# EAGLE design Motor Controller V.5 (EAGLE 9.6.2)
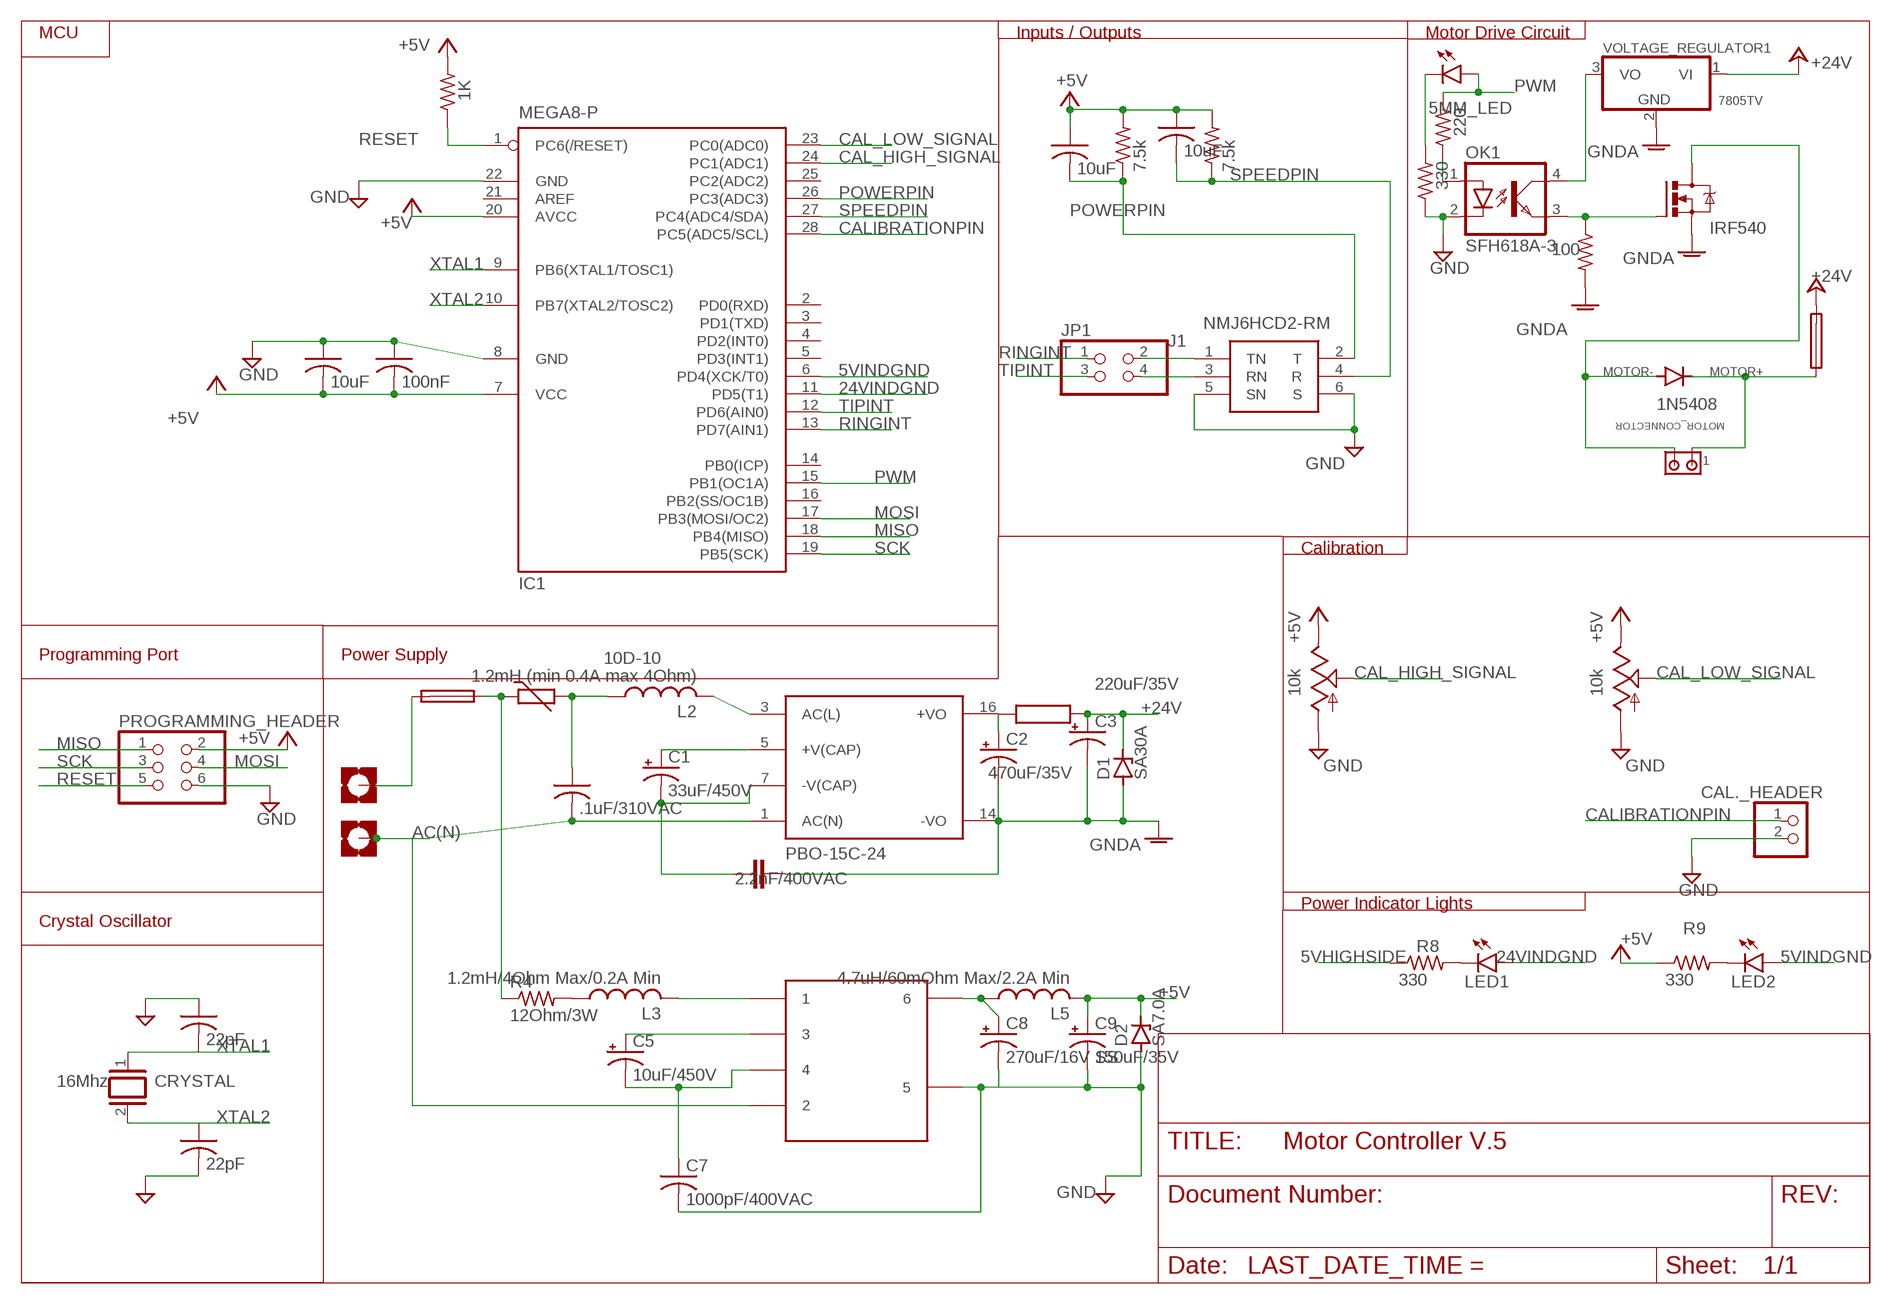
[diagram p0: schematic, sheet 1]

## Parts
1N5408  1N5408  1N5400  [DO201-15]
AC(N)  PAD3.0  [3,0-PAD-SQUARE]
C1  33uF/450V  CPOL-USE5-13  [E5-13]
C2  470uF/35V  CPOL-USE5-10.5  [E5-10,5]
C3  220uF/35V  CPOL-USE5-10.5  [E5-10,5]
C4  .1uF/310VAC  CMPP_AC275V104K10S6  [C102-064X133]
C5  10uF/450V  CPOL-USE5-10.5  [E5-10,5]
C6  22pF  C-US025-024X044  [C025-024X044]
C7  1000pF/400VAC  C-US075-052X106  [C075-052X106]
C8  270uF/16V SS  CPOL-USE2.5-6  [E2,5-6]
C9  150uF/35V  CPOL-USE3.5-8  [E3,5-8]
C10  10uF  C-US025-024X044  [C025-024X044]
C12  10uF  C-US025-024X044  [C025-024X044]
C13  10uF  C-US025-024X044  [C025-024X044]
C14  100nF  C-US025-024X044  [C025-024X044]
C15  22pF  C-US025-024X044  [C025-024X044]
CAL._HEADER  PINHD-1X2  [1X02]
CRYSTAL  16Mhz  XTAL/S  [QS]
CY1  2.2nF/400VAC  CYYC10B4  [YC10B4]
D1  SA30A  TVSDIO  [TVS-10]
D2  SA7.0A  TVSDIO  [TVS-10]
F1  FUSESH22,5  [SH22,5]
F2  1A/300V  FUSESH22,5  [SH22,5]
FAST  10k  TRIM_US-CT6  [CT6]
H1  PAD3.0  [3,0-PAD-SQUARE]
IC1  MEGA8-P  [DIL28-3]
J1  NMJ6HCD2-RM  [NMJ6HCD2RM]
JP1  PINHD-2X2  [2X02]
L2  1.2mH (min 0.4A max 4Ohm)  RCP_1317_INDUCTOR  [RCP1317_INDUCTOR]
L3  1.2mH/4Ohm Max/0.2A Min  RCP_1317_INDUCTOR  [RCP1317_INDUCTOR]
L5  4.7uH/60mOhm Max/2.2A Min  RLB0914_INDUCTOR  [RLB0914_INDUCTOR]
LED1  LED3MM  [LED3MM]
LED2  LED3MM  [LED3MM]
MOTOR_CONNECTOR  MATE-N-LOK_193839-1  [MATE-N-LOK_2PIN_CONNECTOR]
OK1  SFH618A-3  [DIP4]
PROGRAMMING_HEADER  PINHD-2X3  [2X03]
PS1  PBO-15C-24  [CONV_PBO-15C-24]
Q1  IRF540  [TO220BV]
R1  10D-10  THERMISTOR-7,5  [R-7,5]
R2  1K  R-US_0204/7  [0204/7]
R3  7.5k  R-US_0204/7  [0204/7]
R4  12Ohm/3W  R-US_VTA52  [VTA52]
R5  220  R-US_0204/7  [0204/7]
R6  100  R-US_0204/7  [0204/7]
R7  7.5k  R-US_0204/7  [0204/7]
R8  330  R-US_0204/7  [0204/7]
R9  330  R-US_0204/7  [0204/7]
R10  330  R-US_0204/7  [0204/7]
SLOW  10k  TRIM_US-CT6  [CT6]
U$1  L503-13B05R  [LS03-13BO5R3]
U$2  HCTI-22-16.4  [HCTI-22-16.4]
U$3  5MM_LED  [5MM_LED]
VOLTAGE_REGULATOR1  7805TV  [TO220V]

## Nets
5VHIGHSIDE: R8.1
5VINDGND: IC1.6(PD4(XCK/T0)) LED2.A
24VINDGND: IC1.11(PD5(T1)) LED1.A
+5V: C9.+ C10.1 C12.1 C13.2 C14.2 D2.C FAST.E IC1.7(VCC) IC1.20(AVCC) L5.P$2 PROGRAMMING_HEADER.2 R2.2 R3.2 R7.2 R9.1 SLOW.E
+24V: C3.+ D1.C F1.2 U$2.P$2 VOLTAGE_REGULATOR1.1(VI)
AC(L): L2.P$2 PS1.3(AC(L))
AC(N): AC(N).B3,0(MOUNT) C4.2 PS1.1(AC(N)) U$1.3 U$1.4
CAL_HIGH_SIGNAL: FAST.S IC1.24(PC1(ADC1))
CAL_LOW_SIGNAL: IC1.23(PC0(ADC0)) SLOW.S
CALIBRATIONPIN: CAL._HEADER.1 IC1.28(PC5(ADC5/SCL))
GND: C6.2 C7.2 C8.- C9.- C13.1 C14.1 C15.1 CAL._HEADER.2 D2.A FAST.A IC1.8(GND) IC1.22(GND) J1.5(SN) J1.6(S) OK1.2(C) PROGRAMMING_HEADER.6 R10.1 SLOW.A U$1.9 U$1.10
GNDA: C2.- C3.- CY1.1 D1.A PS1.14(-VO) Q1.S R6.2 VOLTAGE_REGULATOR1.2(GND)
MISO: IC1.18(PB4(MISO)) PROGRAMMING_HEADER.1
MOSI: IC1.17(PB3(MOSI/OC2)) PROGRAMMING_HEADER.4
MOTOR+: 1N5408.C F1.1 MOTOR_CONNECTOR.P$1
MOTOR-: 1N5408.A MOTOR_CONNECTOR.P$2 Q1.D
N$1: OK1.1(A) R5.1
N$2: OK1.3(EMIT) Q1.G R6.1
N$3: LED1.K(C) R8.2
N$4: C2.+ PS1.16(+VO) U$2.P$1
N$5: C1.+ PS1.5(+V(CAP))
N$6: C1.- CY1.2 PS1.7(-V(CAP))
N$7: J1.1(TN) JP1.2
N$8: F2.2 H1.B3,0(MOUNT)
N$9: F2.1 R1.1 R4.1
N$10: C4.1 L2.P$1 R1.2
N$11: J1.3(RN) JP1.4
N$12: LED2.K(C) R9.2
N$13: L3.P$1 R4.2
N$14: L3.P$2 U$1.1 U$1.2
N$15: C5.+ U$1.5 U$1.6
N$16: C5.- C7.1 U$1.7 U$1.8
N$17: C8.+ L5.P$1 U$1.11 U$1.12
N$18: OK1.4(COL) VOLTAGE_REGULATOR1.3(VO)
N$19: R10.2 U$3.C
POWERPIN: C10.2 IC1.26(PC3(ADC3)) J1.2(T) R3.1
PWM: IC1.15(PB1(OC1A)) R5.2 U$3.A
RESET: IC1.1(PC6(/RESET)) PROGRAMMING_HEADER.5 R2.1
RINGINT: IC1.13(PD7(AIN1)) JP1.1
SCK: IC1.19(PB5(SCK)) PROGRAMMING_HEADER.3
SPEEDPIN: C12.2 IC1.27(PC4(ADC4/SDA)) J1.4(R) R7.1
TIPINT: IC1.12(PD6(AIN0)) JP1.3
XTAL1: C15.2 CRYSTAL.1 IC1.9(PB6(XTAL1/TOSC1))
XTAL2: C6.1 CRYSTAL.2 IC1.10(PB7(XTAL2/TOSC2))
Unconnected: IC1.2(PD0(RXD)) IC1.3(PD1(TXD)) IC1.4(PD2(INT0)) IC1.5(PD3(INT1)) IC1.14(PB0(ICP)) IC1.16(PB2(SS/OC1B)) IC1.21(AREF) IC1.25(PC2(ADC2))

## Notes on the sheet
- MCU | Inputs / Outputs | Motor Drive Circuit
- Calibration
- Programming Port | Power Supply
- Power Indicator Lights
- Crystal Oscillator

## Library data of the parts
1N5408 = diode:1N5400: DIODE standard rectifier, 3 A, 50 V (Motorola); MF: VISHAY; MPN: 1N5408-E3/54; OC_NEWARK: 05R6001
AC(N) H1 = Benson Motor Controller:PAD3.0; OC_NEWARK: unknown
C1 C5 C8 C9 = rcl:CPOL-US: POLARIZED CAPACITOR, American symbol; OC_NEWARK: unknown; SPICEPREFIX: C
C2 = rcl:CPOL-US: POLARIZED CAPACITOR, American symbol; MF: PANASONIC; MPN: ECA1VHG471B; OC_NEWARK: 65AH6137; SPICEPREFIX: C
C3 = rcl:CPOL-US: POLARIZED CAPACITOR, American symbol; MF: KEMET; MPN: A768KS227M1VLAE024; OC_NEWARK: 92AH3968; SPICEPREFIX: C
C4 = Benson Motor Controller:CMPP_AC275V104K10S6: capacitor .1uf 275VAC; OC_NEWARK: unknown
C6 C7 C10 C12-C15 = rcl:C-US: CAPACITOR, American symbol; OC_NEWARK: unknown; SPICEPREFIX: C
CAL._HEADER = pinhead:PINHD-1X2: PIN HEADER; OC_NEWARK: unknown
CRYSTAL = special:XTAL/S: CRYSTAL; OC_NEWARK: unknown
CY1 = rcl:CY: Y CAPACITOR for power line; OC_NEWARK: unknown; SPICEPREFIX: C
D1 D2 = Benson Motor Controller:TVSDIO: TVS diode 9.0mm hole spacing; OC_NEWARK: unknown
F1 F2 = fuse:FUSE: Fuse; OC_FARNELL: unknown; OC_NEWARK: unknown
FAST SLOW = pot:TRIM_US-: POTENTIOMETER; OC_NEWARK: unknown
IC1 = atmel:MEGA8-P: MICROCONTROLLER 8 Kbytes FLASH, 1 kbytes SRAM, 512 bytes EEPROM, USART, 4-channel 10 bit ADC, 2-channel 8 bit ADC Pin compatible with Atmega48, ATMega88, ATMega168 Source: avr.lbr; OC_FARNELL: unknown; OC_NEWARK: unknown
J1 = SamacSys_Parts:NMJ6HCD2-RM: NMJ6HCD2-RM Phone Connectors 1/4" STERO JCK SWTCH FULL TRD NSE PC HORZ Source: Datasheet <https://www.mouser.com/datasheet/2/289/st-nmj6hcd2-1842677.pdf>; DESCRIPTION: NMJ6HCD2-RM Phone Connectors 1/4" STERO JCK SWTCH FULL TRD NSE PC HORZ; HEIGHT: 15.67mm; MANUFACTURER_NAME: Neutrik; MANUFACTURER_PART_NUMBER: NMJ6HCD2-RM; MOUSER_PART_NUMBER: 568-NMJ6HCD2-RM; MOUSER_PRICE-STOCK: https://www.mouser.co.uk/ProductDetail/Neutrik/NMJ6HCD2-RM?qs=%252B86TLfaev28zLpqKj2fOGg%3D%3D; OC_NEWARK: unknown
JP1 = pinhead:PINHD-2X2: PIN HEADER; OC_NEWARK: unknown
L2 L3 = Benson Motor Controller:RCP_1317_INDUCTOR; OC_NEWARK: unknown
L5 = Benson Motor Controller:RLB0914_INDUCTOR; OC_NEWARK: unknown
LED1 LED2 = led:LED: LED OSRAM: - CHIPLED LG R971, LG N971, LY N971, LG Q971, LY Q971, LO R971, LY R971 LH N974, LH R974 LS Q976, LO Q976, LY Q976 LO Q996 - Hyper CHIPLED LW Q18S LB Q993, LB Q99A, LB R99A - SideLED LS A670, LO A670, LY A670, LG A670, LP A670 LB A673, LV A673, LT A673, LW A673 LH A674 LY A675 LS A676, LA A676, LO A676, LY A676, LW A676 LS A679, LY A679, LG A679 - Hyper Micro SIDELED® LS Y876, LA Y876, LO Y876, LY Y876 LT Y87S - SmartLED LW L88C, LW L88S LB L89C, LB L89S, LG L890 LS L89K, LO L89K, LY L89K LS L896, LA L896, LO L896, LY L896 - TOPLED LS T670, LO T670, LY T670, LG T670, LP T670 LSG T670, LSP T670, LSY T670, LOP T670, LYG T670 LG T671, LOG T671, LSG T671 LB T673, LV T673, LT T673, LW T673 LH T674 LS T676, LA T676, LO T676, LY T676, LB T676, LH T676, LSB T676, LW T676 LB T67C, LV T67C, LT T67C, LS T67K, LO T67K, LY T67K, LW E67C LS E67B, LA E67B, LO E67B, LY E67B, LB E67C, LV E67C, LT E67C LW T67C LS T679, LY T679, LG T679 LS T770, LO T770, LY T770, LG T770, LP T770 LB T773, LV T773, LT T773, LW T773 LH T774 LS E675, LA E675, LY E675, LS T675 LS T776, LA T776, LO T776, LY T776, LB T776 LHGB T686 LT T68C, LB T68C - Hyper Mini TOPLED® LB M676 - Mini TOPLED Santana® LG M470 LS M47K, LO M47K, LY M47K Source: http://www.osram.convergy.de LUXEON: - LUMILED® LXK2-PW12-R00, LXK2-PW12-S00, LXK2-PW14-U00, LXK2-PW14-V00 LXK2-PM12-R00, LXK2-PM12-S00, LXK2-PM14-U00 LXK2-PE12-Q00, LXK2-PE12-R00, LXK2-PE12-S00, LXK2-PE14-T00, LXK2-PE14-U00 LXK2-PB12-K00, LXK2-PB12-L00, LXK2-PB12-M00, LXK2-PB14-N00, LXK2-PB14-P00, LXK2-PB14-Q00 LXK2-PR12-L00, LXK2-PR12-M00, LXK2-PR14-Q00, LXK2-PR14-R00 LXK2-PD12-Q00, LXK2-PD12-R00, LXK2-PD12-S00 LXK2-PH12-R00, LXK2-PH12-S00 LXK2-PL12-P00, LXK2-PL12-Q00, LXK2-PL12-R00 Source: www.luxeon.com KINGBRIGHT: KA-3528ASYC Source: www.kingbright.com
MOTOR_CONNECTOR = Benson Motor Controller:MATE-N-LOK_193839-1: right angle connector mate n lok 193839-1 mates with pn 770017-1; OC_NEWARK: unknown
OK1 = optocoupler:SFH618?*: Optocoupler, Phototransistor Output, Low Input Current Source: Data sheet <http://www.vishay.com/docs/83673/sfh618.pdf>; MF: VISHAY/TELEFUNKEN; MPN: SFH618A-3; OC_FARNELL: 1020374; OC_NEWARK: 58K2209
PROGRAMMING_HEADER = pinhead:PINHD-2X3: PIN HEADER; OC_NEWARK: unknown
PS1 = Benson Motor Controller:PBO-15C-24: Check prices <https://pricing.snapeda.com/parts/PBO-15C-24/CUI%20Inc./view-part?ref=eda>; AVAILABILITY: Warning; CUI_PURCHASE_URL: https://www.cui.com/product/internal-ac-dc-power-supplies/board-mount/pbo-15c-series?utm_source=snapeda.com&utm_medium=referral&utm_campaign=snapedaBOM; DESCRIPTION: 15 W, 85 ~ 305 Vac Input, Single Output, Open Frame, Board Mount, Ac-Dc Power Supply; MF: CUI Inc.; MP: PBO-15C-24; OC_NEWARK: unknown; PACKAGE: None; PRICE: None; PURCHASE-URL: https://pricing.snapeda.com/search/part/PBO-15C-24/?ref=eda
Q1 = transistor-power:IRF540: HEXFET Power MOSFET; OC_NEWARK: unknown
R1 = Benson Motor Controller:THERMISTOR: THERMISTOR Inrush current limiting resitor 10ohm 20% 2A 11mm datasheet <https://www.cantherm.com/wp-content/uploads/2018/08/MF72_AUG_2018.pdf>; OC_NEWARK: unknown
R2-R7 R10 = rcl:R-US_: RESISTOR, American symbol; OC_NEWARK: unknown; SPICEPREFIX: R
R8 R9 = rcl:R-US_: RESISTOR, American symbol; SPICEPREFIX: R
U$1 = Benson Motor Controller:L503-13B05R: Mornsun 5V 3W Isolated Power supply LS03-13B05R Datasheet <https://www.mornsun-power.com/html/pdf/LS03-13BxxR3.html>; OC_NEWARK: unknown
U$2 = Benson Motor Controller:HCTI-22-16.4
U$3 = Benson Motor Controller:5MM_LED
VOLTAGE_REGULATOR1 = linear:78*: Positive VOLTAGE REGULATOR Source: http://cache.national.com/ds/LM/LM78L05.pdf http://www.fairchildsemi.com/ds/LM/LM7805.pdf; OC_NEWARK: unknown

## Board
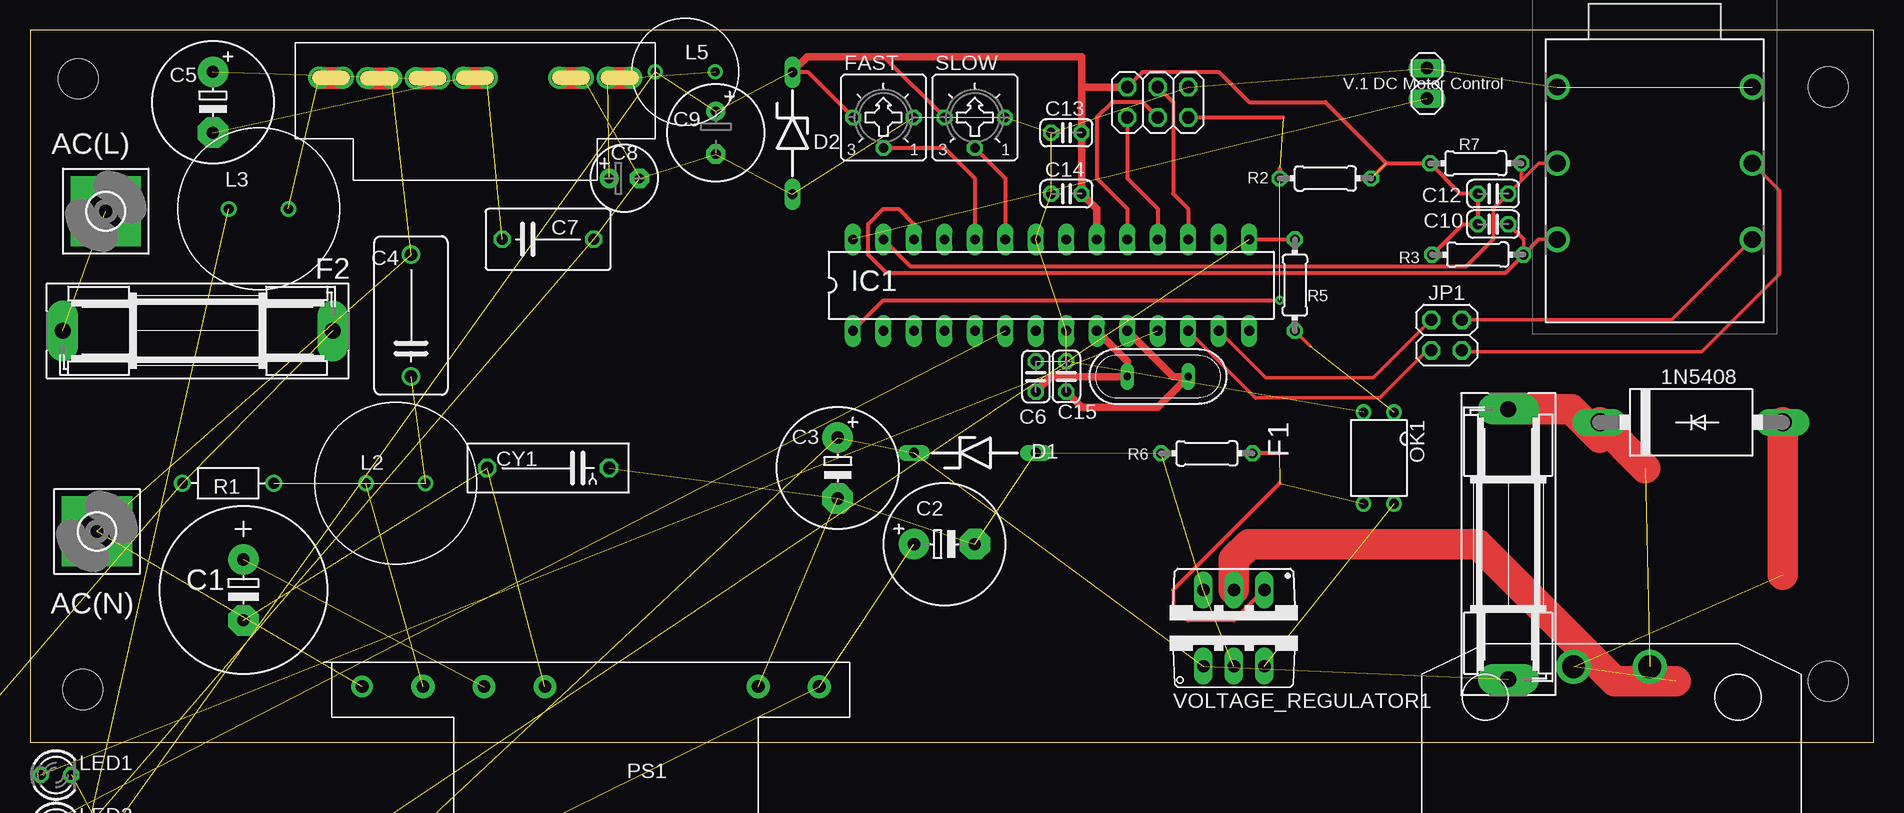
[diagram p1: board, top side]
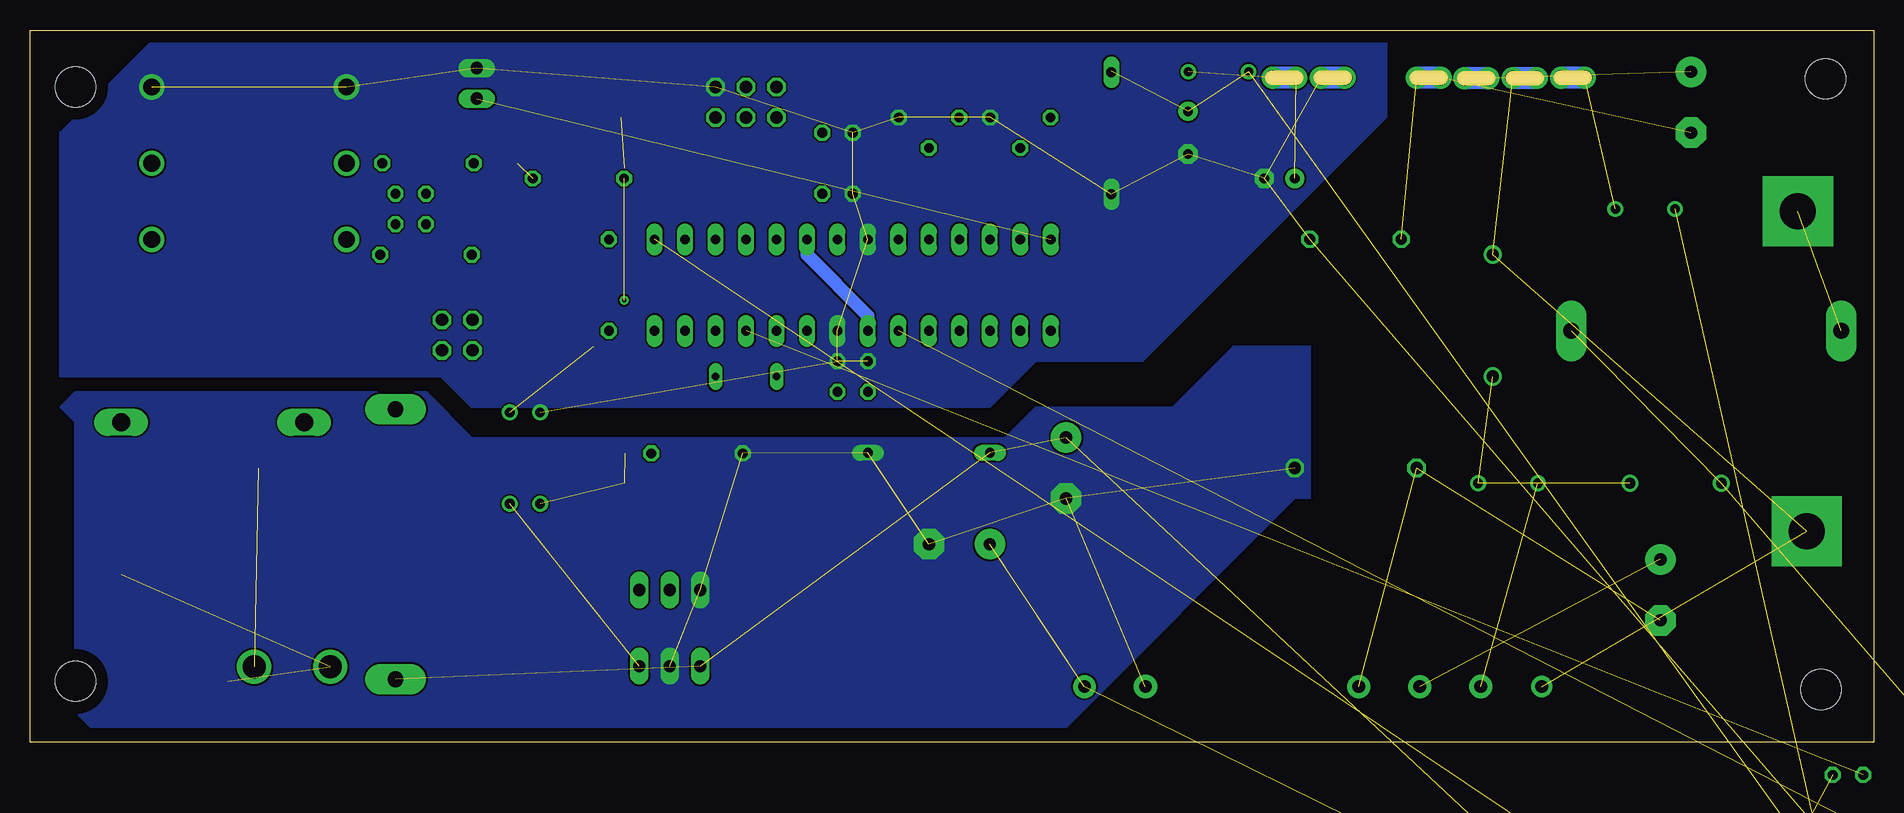
[diagram p2: board, bottom side, seen from below]

Size 153.65 x 59.36 mm. Coordinates in mm from the lower left corner, seen from the top.
Outline: 0,0 153.65,0 153.65,59.36 0,59.36 0,0
Copper layers (1*16): Top 0.035mm / dielectric 1.5mm / Bottom 0.035mm
Design rules "default *": minimum track width 6mil, minimum drill 0.35mm, track to track 6mil, track to pad 6mil, pad to pad 6mil, via to via 6mil, smd to smd 6mil, copper to edge 40mil, drill to drill 6mil, minimum pad ring 10mil, minimum via ring 8mil, stop-mask expansion 4mil, vias tented up to drill 0mil, thermal gap 0mil
Holes 3.33 mm at 149.86,54.61 149.86,5.08 4.03,55.29 4.4,4.4

### Footprints (pad centres in the part's own frame; a part is rotated, then mirrored left to right if it is on the bottom)
DO201-15 = drill 1.499 long: A 7.62,0; C -7.62,0
3,0-PAD-SQUARE = drill 3 pad 5.842 square: B3,0 0,0
E5-13 = drill 1.016 pad 2.54: + -2.54,0 | drill 1.016 pad 2.54 octagon: - 2.54,0
E5-10,5 = drill 1.016 pad 2.54: + -2.54,0 | drill 1.016 pad 2.54 octagon: - 2.54,0
C102-064X133 = drill 1.016: 1 -5.08,0; 2 5.08,0
C025-024X044 = drill 0.813 octagon: 1 -1.27,0; 2 1.27,0
C075-052X106 = drill 0.914 octagon: 1 -3.81,0; 2 3.81,0
E2,5-6 = drill 0.813 pad 1.6: + -1.27,0 | drill 0.813 pad 1.6 octagon: - 1.27,0
E3,5-8 = drill 0.813 pad 1.6: + -1.778,0 | drill 0.813 pad 1.6 octagon: - 1.778,0
1X02 = drill 1.016 long: 1 -1.27,0; 2 1.27,0
QS = drill 0.61 long: 1 -2.54,0; 2 2.54,0
YC10B4 = drill 1.016 octagon: 1 -5.08,0; 2 5.08,0
TVS-10 = drill 0.813 long: A 5.08,0; C -5.08,0
SH22,5 = drill 1.321 pad 2.54 long: 1 -11.252,0; 2 11.252,0
CT6 = drill 0.813 octagon: A 2.515,0; E -2.515,0; S 0,-2.54
DIL28-3 = drill 0.813 long: 1 -16.51,-3.81; 2 -13.97,-3.81; 3 -11.43,-3.81; 4 -8.89,-3.81; 5 -6.35,-3.81; 6 -3.81,-3.81; 7 -1.27,-3.81; 8 1.27,-3.81; 9 3.81,-3.81; 10 6.35,-3.81; 11 8.89,-3.81; 12 11.43,-3.81; 13 13.97,-3.81; 14 16.51,-3.81; 15 16.51,3.81; 16 13.97,3.81; 17 11.43,3.81; 18 8.89,3.81; 19 6.35,3.81; 20 3.81,3.81; 21 1.27,3.81; 22 -1.27,3.81; 23 -3.81,3.81; 24 -6.35,3.81; 25 -8.89,3.81; 26 -11.43,3.81; 27 -13.97,3.81; 28 -16.51,3.81
NMJ6HCD2RM = drill 1.4 pad 2.1: 1 0,0; 2 0,16.23; 3 6.35,0; 4 6.35,16.23; 5 12.7,0; 6 12.7,16.23
2X02 = drill 1.016 octagon: 1 -1.27,-1.27; 2 -1.27,1.27; 3 1.27,-1.27; 4 1.27,1.27
RCP1317_INDUCTOR = drill 0.8: P$1 0,2.489; P$2 0,-2.489
RLB0914_INDUCTOR = drill 0.75: P$1 2.502,0; P$2 -2.502,0
LED3MM = drill 0.813 octagon: A -1.27,0; K 1.27,0
MATE-N-LOK_2PIN_CONNECTOR = drill 1.905: P$1 -3.175,-2.54; P$2 3.175,-2.54
DIP4 = drill 0.8: 1 -1.27,-3.81; 2 1.27,-3.81; 3 1.27,3.81; 4 -1.27,3.81
2X03 = drill 1.016 octagon: 1 -2.54,-1.27; 2 -2.54,1.27; 3 0,-1.27; 4 0,1.27; 5 2.54,-1.27; 6 2.54,1.27
CONV_PBO-15C-24 = drill 1.067 pad 1.778: 1 -19.05,0 | drill 1.067 pad 1.93: 3 -13.97,0; 14 13.97,0 | drill 1.067 pad 1.905: 5 -8.89,0; 7 -3.81,0; 16 19.05,0
TO220BV = drill 1.016 long: D 0,-2.54; G -2.54,-2.54; S 2.54,-2.54
R-7,5 = drill 0.9: 1 -3.81,0; 2 3.81,0
0204/7 = drill 0.813 octagon: 1 -3.81,0; 2 3.81,0
VTA52 = drill 1.1 octagon: 1 -15.24,0; 2 15.24,0
LS03-13BO5R3 = drill 1.219 pad 1.829: 1 -13.011,5.109; 2 -11.03,5.109; 3 -8.992,5.08; 4 -7.01,5.08; 5 -4.957,5.053; 6 -2.976,5.053; 7 -0.996,5.097; 8 0.985,5.097; 9 6.991,5.086; 10 8.972,5.086; 11 11.049,5.086; 12 13.007,5.109
HCTI-22-16.4 = drill 2.032 pad 3.556: P$1 0,8.128; P$2 0,-8.128
5MM_LED = drill 1.21: A 1.27,0 | drill 1.21 square: C -1.27,0
TO220V = drill 1.016 long: 1 -2.54,-2.54; 2 0,-2.54; 3 2.54,-2.54

### Placement (x,y rotation side)
1N5408  138.43,26.67 0 top
AC(N)  5.58,17.57 0 top
C1  17.78,12.7 270 top
C2  76.2,16.51 0 top
C3  67.31,22.86 270 top
C4  31.75,35.56 90 top
C5  15.24,53.34 270 top
C6  86.36,30.48 90 top
C7  43.18,41.91 0 top
C8  49.53,46.99 0 top
C9  57.15,50.8 270 top
C10  121.92,43.18 0 top
C12  121.92,45.72 0 top
C13  86.36,50.8 0 top
C14  86.36,45.72 0 top
C15  83.82,30.48 270 top
CAL._HEADER  116.42,54.92 90 top
CRYSTAL  93.98,30.48 0 top
CY1  43.18,22.86 180 top
D1  78.74,24.13 0 top
D2  63.54,50.75 270 top
F1  123.19,16.51 270 top
F2  13.97,34.29 180 top
FAST  71.12,52.07 0 top
H1  6.32,44.26 0 top
IC1  85.09,38.1 0 top
J1  143.51,41.91 90 top
JP1  118.05,33.93 270 top
L2  30.48,21.59 270 top
L3  19.05,44.45 90 top
L5  54.61,55.88 0 top
LED1  2.16,-2.72 0 top
LED2  2.16,-7.09 0 top  (outside the outline)
MOTOR_CONNECTOR  131.8,3.75 180 top
OK1  112.4,23.69 180 top
PROGRAMMING_HEADER  93.98,53.34 0 top
PS1  46.73,4.65 0 top
Q1  100.33,10.16 180 top
R1  16.51,21.59 0 top
R2  107.95,46.99 0 top
R3  120.65,40.64 180 top
R4  -15.24,-28.48 0 top  (outside the outline)
R5  105.41,38.1 90 top
R6  98.07,24.08 180 top
R7  120.48,48.26 180 top
R8  4.57,-11.97 0 top  (outside the outline)
R9  4.57,-15.78 0 top  (outside the outline)
R10  -33.6,-55.94 0 top  (outside the outline)
SLOW  78.74,52.07 0 top
U$1  37.1,50.28 0 top
U$2  -14.83,-43.21 0 top  (outside the outline)
U$3  -34.77,-48.67 0 top  (outside the outline)
VOLTAGE_REGULATOR1  100.33,8.89 0 top

### Tracks (layer width: path | path; a pad name or v marks a point on that pad's centre or on a via)
5VINDGND  (1 unrouted)
24VINDGND  (1 unrouted)
+5V  (4 unrouted)
  Top 0.318: D2.C 63.59,55.88 64.8,55.88 FAST.E | 69.85,57.15 71.14,57.15 SLOW.E | R3.2 119.38,43.18 C10.1 C12.1 119.2,45.72 R7.2 113.03,48.26 R2.2 | PROGRAMMING_HEADER.2 92.71,55.88 99.06,55.88 101.6,53.34 107.95,53.34 113.03,48.26
  Top 0.635: D2.C 63.54,55.92 64.77,57.15 69.85,57.15 87.63,57.15 87.63,54.61 | 87.63,54.61 PROGRAMMING_HEADER.2 | 87.63,54.61 C13.2 C14.2 88.9,44.45 IC1.20
  Bottom 1.143: IC1.20 88.9,40.64 83.82,35.56 IC1.7
+24V  (4 unrouted)
AC(L)  (1 unrouted)
AC(N)  (4 unrouted)
CAL_HIGH_SIGNAL
  Top 0.318: FAST.S 76.2,49.53 78.74,46.99 IC1.24
CAL_LOW_SIGNAL
  Top 0.318: SLOW.S 81.28,46.99 IC1.23
CALIBRATIONPIN  (1 unrouted)
GND  (19 unrouted)
  pour Bottom: 40.64,58.49 40.64,52.07 60.96,31.75 69.85,31.75 73.66,27.94 116.84,27.94 119.38,30.48 151.13,30.48 151.13,50.8 143.44,58.49
GNDA  (7 unrouted)
  pour Bottom: 151.13,27.94 149.86,29.21 120.65,29.21 116.84,25.4 72.39,25.4 69.85,27.94 58.42,27.94 53.34,33.02 46.99,33.02 46.99,20.32 48.26,20.32 67.31,1.27 148.59,1.27 149.86,2.54 149.86,26.67
MISO
  Top 0.318: PROGRAMMING_HEADER.1 91.44,46.99 93.98,44.45 IC1.18
MOSI
  Top 0.318: PROGRAMMING_HEADER.4 95.25,53.34 95.25,45.72 96.52,44.45 IC1.17
MOTOR+  (1 unrouted)
  Top 2.54: F1.1 128.45,27.76 130.81,25.4 1N5408.C 134.62,22.86
MOTOR-  (2 unrouted)
  Top 2.54: 1N5408.A 146.05,13.97 | Q1.D 100.33,15.24 101.6,16.51 120.65,16.51 132.08,5.08 137.16,5.08
N$1  (1 unrouted)
  Top 0.305: R5.1 106.68,33.02
N$2  (2 unrouted)
  Top 0.305: 96.52,10.16 100.33,10.16
  Top 0.318: 104.09,24.08 R6.1 | 96.52,10.16 95.25,11.43 95.25,12.7 104.14,21.59 | 100.33,10.16 Q1.G
N$3  (1 unrouted)
N$4  (2 unrouted)
N$5  (1 unrouted)
N$6  (2 unrouted)
N$7
  Top 0.305: J1.1 136.8,35.2 JP1.2
N$8  (1 unrouted)
N$9  (2 unrouted)
N$10  (2 unrouted)
N$11
  Top 0.305: J1.3 145.79,45.98 145.79,39.04 139.32,32.56 119.42,32.56 JP1.4
N$12  (1 unrouted)
N$13  (1 unrouted)
N$14  (2 unrouted)
N$15  (2 unrouted)
N$16  (3 unrouted)
N$17  (3 unrouted)
N$18  (1 unrouted)
N$19  (1 unrouted)
POWERPIN
  Top 0.305: 124.46,41.91 R3.1 | 125.73,41.91 J1.2
  Top 0.318: 125.73,41.91 R3.1 122.96,39.14 71.35,39.14 69.85,40.64 69.85,43.18 71.12,44.45 72.39,44.45 73.66,43.18 IC1.26 | C10.2 124.46,41.91
PWM  (1 unrouted)
  Top 0.318: IC1.15 R5.2
RESET  (via drill 0.35)  (2 unrouted)
  Top 0.318: PROGRAMMING_HEADER.5 104.42,52.07 | 104.14,47.83 R2.1 | IC1.1 71.12,36.83 v104.14,36.83
RINGINT
  Top 0.305: IC1.13 102.98,30.37 111.95,30.37 JP1.1
SCK
  Top 0.318: PROGRAMMING_HEADER.3 92.71,53.34 90.17,53.34 88.9,52.07 88.9,46.99 91.44,44.45 IC1.19
SPEEDPIN
  Top 0.305: C12.2 124.29,46.82 | 124.29,46.82 R7.1 | 124.29,46.82 125.73,48.26 J1.4
  Top 0.318: C12.2 121.92,44.45 121.92,41.91 119.64,39.63 73.4,39.63 IC1.27
TIPINT
  Top 0.305: IC1.12 102.1,28.71 | 102.1,28.71 102.13,28.68 | 102.1,28.71 112.5,28.71 116.45,32.66 JP1.3
XTAL1
  Top 0.635: IC1.9 91.44,31.75 CRYSTAL.1 85.09,30.48 C15.2
XTAL2
  Top 0.635: IC1.10 95.25,30.48 CRYSTAL.2 93.98,27.94 87.63,27.94 C6.1

### Text on the board
tPlace: AC(L) | AC(N)
tNames: V.1 DC Motor Control